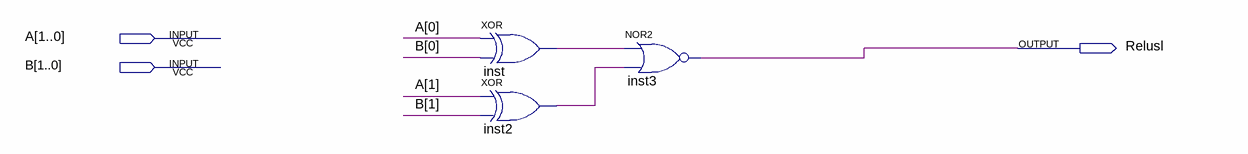
[diagram p0: schematic sheet]
// Quartus schematic Task04.bdf as structural Verilog: 3 symbols, 3 pins
module Task04 (
  input  [1:0] A,
  input  [1:0] B,
  output Relusl
);

  wire inst2_out, inst_out;

  xor inst (inst_out, A[0], B[0]);
  xor inst2 (inst2_out, A[1], B[1]);
  nor inst3 (Relusl, inst_out, inst2_out);
endmodule
